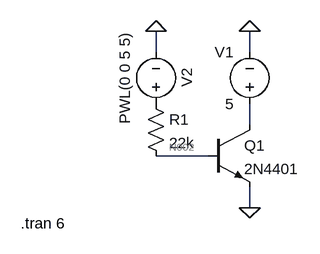
[diagram p0: schematic Übertragungskennlinie2.asc]
Übertragungskennlinie2.asc, the LTspice schematic file:
Version 4.1
SHEET 1 880 680
WIRE 224 96 224 64
WIRE 368 96 368 64
WIRE 368 208 368 176
WIRE 304 256 224 256
WIRE 368 336 368 304
FLAG 368 64 0
FLAG 368 336 0
FLAG 224 64 0
SYMBOL npn 304 208 R0
SYMATTR InstName Q1
SYMATTR Value 2N4401
SYMBOL voltage 368 192 R180
WINDOW 0 24 96 Left 2
WINDOW 3 24 16 Left 2
WINDOW 123 0 0 Left 0
WINDOW 39 0 0 Left 0
SYMATTR InstName V1
SYMATTR Value 5
SYMBOL voltage 224 192 R180
WINDOW 0 -32 56 VBottom 2
WINDOW 3 32 56 VTop 2
WINDOW 123 0 0 Left 0
WINDOW 39 0 0 Left 0
SYMATTR InstName V2
SYMATTR Value PWL(0 0 5 5)
SYMBOL res 208 160 R0
SYMATTR InstName R1
SYMATTR Value 22k
TEXT 16 360 Left 2 !.tran 6

The netlist it stands for:
* Übertragungskennlinie2.asc
Q1 N001 N002 0 0 2N4401
V1 N001 0 5
V2 P001 0 PWL(0 0 5 5)
R1 P001 N002 22k
.model NPN NPN
.model PNP PNP
.lib standard.bjt
.tran 6
.backanno
.end

* Results of the author's LTspice run, read from the files saved beside the schematic
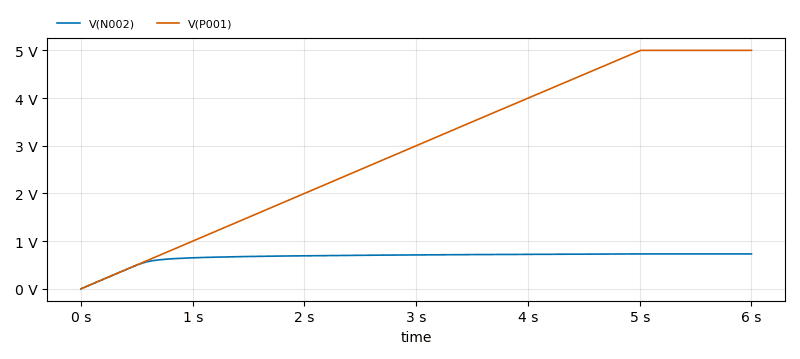
[diagram p1: Transient Analysis of Übertragungskennlinie2.asc, plotted from the saved traces]
* Transient Analysis, 1 run:
*   V(N002): min 110.6 nV, max 731.5 mV, average 663.2 mV, rms 677.3 mV, last 731.5 mV
*   V(P001): min 0 V, max 5 V, average 2.916 V, rms 3.35 V, last 5 V